# Altium schematic sheet X-ADE-12MH+.SchDoc
size A4; Organization1: VINCULADA AO EXÉRCITO BRASILEIRO; Organization2: FÁBRICA DE MATERIAL DE; Organization3: COMUNICAÇÕES E ELETRÔNICA; Organization0: INDÚSTRIA DE MATERIAL BÉLICO DO BRASIL; Esquematico: Esquemático
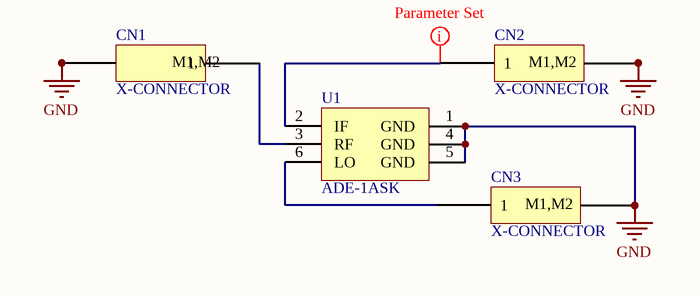
[diagram p0: X-ADE-12MH+.SchDoc]

## Parts
CN1  X-CONNECTOR  [X-CONNECTOR-PCB]
CN2  X-CONNECTOR  [X-CONNECTOR-PCB]
CN3  X-CONNECTOR  [X-CONNECTOR-PCB]
U1  ADE-1ASK  [MINI-CD542-6_V]

## Nets
GND: CN1.M1 CN1.M2 CN2.M1 CN2.M2 CN3.M1 CN3.M2 U1.1(GND) U1.4(GND) U1.5(GND)
NetCN1_1: CN1.1 U1.3(RF)
NetCN2_1: CN2.1 U1.2(IF)
NetCN3_1: CN3.1 U1.6(LO)

## Layout directives
net class 50ohm: NetCN2_1

## Notes on the sheet
- USADO EQUIP.:
- DATA:
- ENG:
- VERIF:
- HORA:
- REV:
- APROV:
- TÍTULO:
- FOLHA:
- /
- FORMATO:
- A4
- CÓDIGO:
- ESTOQUE:
- (in symbol X-CONNECTOR-5) M1,M2

## Library data of the parts
CN1-CN3 = X-CONNECTOR-5: CONECTOR PARA MÓDULOS X MICROWAVE; RoHS: Yes; Mount: TH
U1 = CMP-2000-05756-1: Frequency Mixer, Level 7 (LO Power +7 dBm), 2 to 600 MHz, -40 to 85 degC, 6-Pin CD542, Tape and Reel; Manufacturer: Mini-Circuits; Manufacturer URL: http://www.minicircuits.com/; Package Reference: CD542-6; Datasheet URL: https://www.minicircuits.com/pdfs/ADE-1ASK.pdf; Package Description: 6-Pin Surface Mount Device, Body 5.59 x 7.87 mm, Pitch 2.54 mm; Mounting Technology: SurfaceMount; Package URL: http://www.minicircuits.com/case_styles/CD542.pdf; Datasheet Version: Rev. F, 05/2015